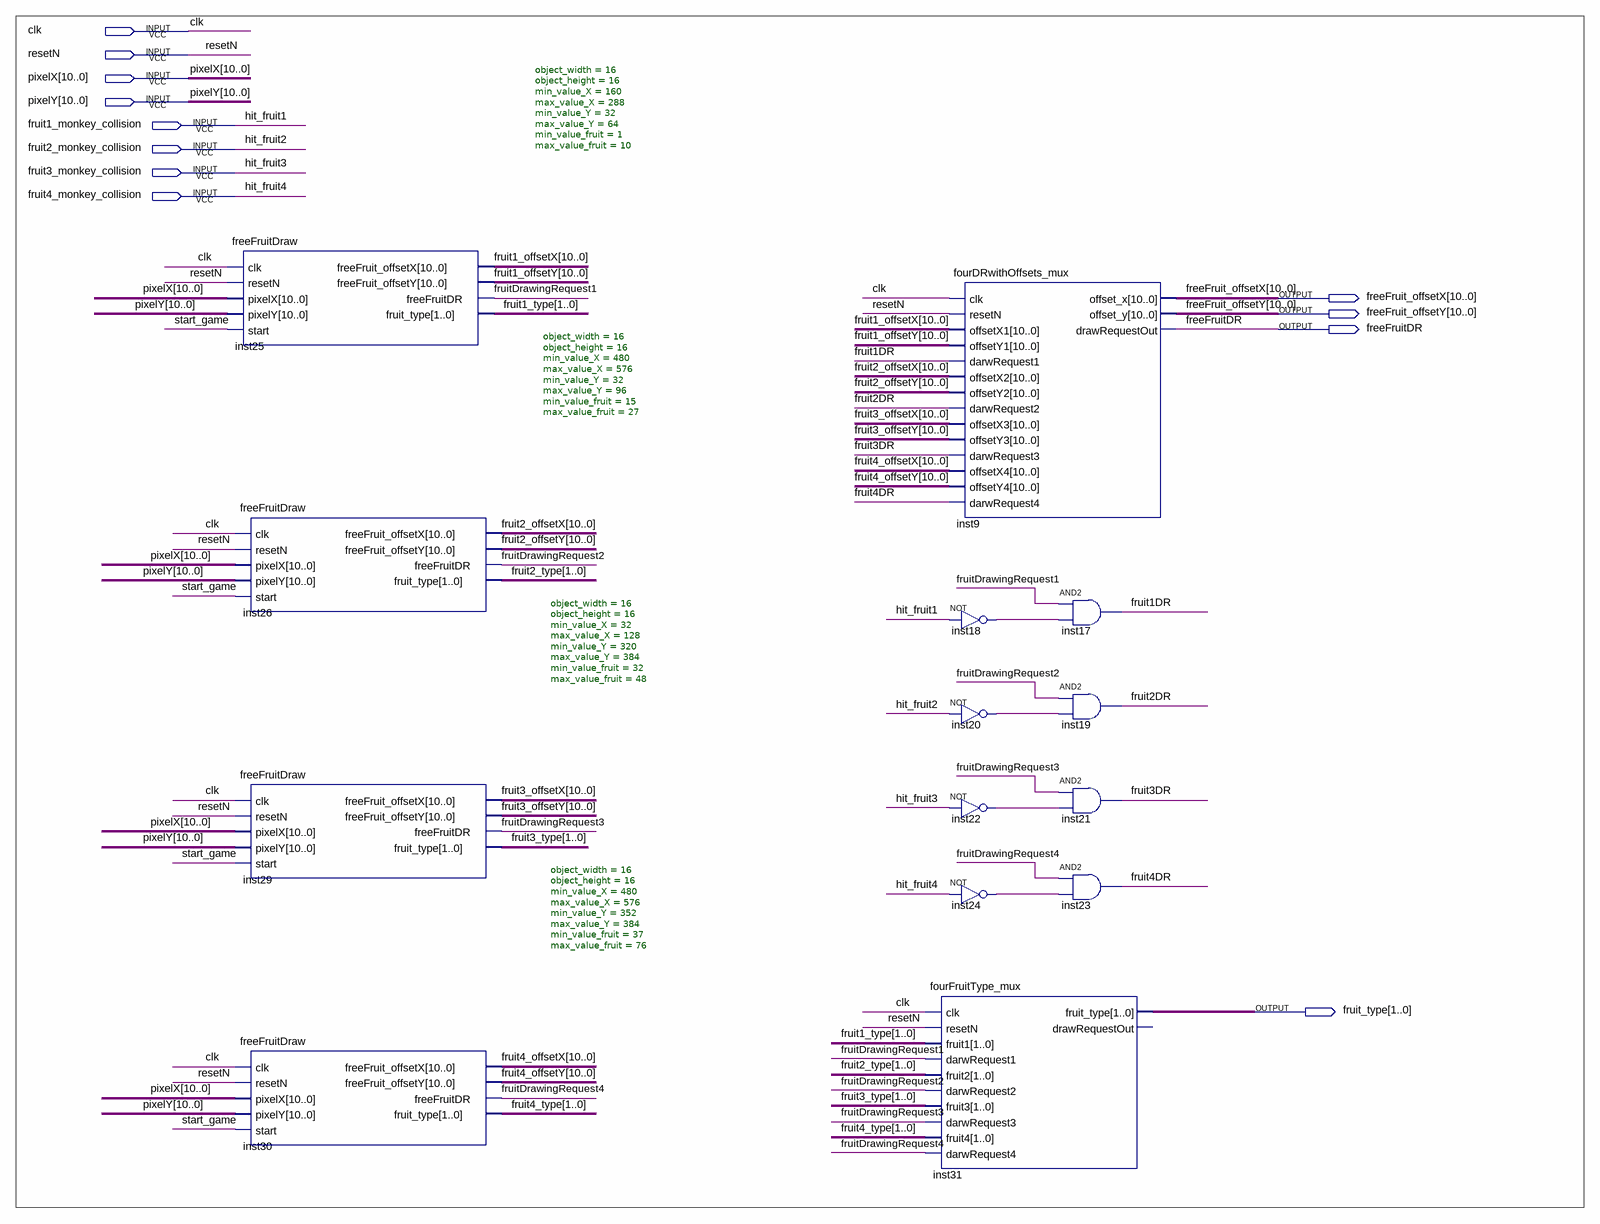
[diagram p0: schematic sheet]
// Quartus schematic freeFruitBlockexample.bdf as structural Verilog: 14 symbols, 12 pins
module freeFruitBlockexample (
  input  clk,
  input  resetN,
  input  [10:0] pixelX,
  input  [10:0] pixelY,
  input  fruit1_monkey_collision,
  input  fruit2_monkey_collision,
  input  fruit3_monkey_collision,
  input  fruit4_monkey_collision,
  output [10:0] freeFruit_offsetX,
  output [10:0] freeFruit_offsetY,
  output freeFruitDR,
  output [1:0] fruit_type
);

  wire fruit1DR, fruit2DR, fruit3DR, fruit4DR, fruitDrawingRequest1, fruitDrawingRequest2,
       fruitDrawingRequest3, fruitDrawingRequest4, inst18_out, inst20_out, inst22_out, inst24_out, start_game;
  wire [1:0] fruit1_type, fruit2_type, fruit3_type, fruit4_type;
  wire [10:0] fruit1_offsetX, fruit1_offsetY, fruit2_offsetX, fruit2_offsetY, fruit3_offsetX, fruit3_offsetY,
       fruit4_offsetX, fruit4_offsetY;

  freeFruitDraw #(.object_width(16), .object_height(16), .min_value_X(160), .max_value_X(288), .min_value_Y(32), .max_value_Y(64), .min_value_fruit(1), .max_value_fruit(10)) inst25 (
    .clk(clk), .resetN(resetN), .pixelX(pixelX), .pixelY(pixelY), .start(start_game),
    .freeFruit_offsetX(fruit1_offsetX), .freeFruit_offsetY(fruit1_offsetY),
    .freeFruitDR(fruitDrawingRequest1), .fruit_type(fruit1_type));
  freeFruitDraw #(.object_width(16), .object_height(16), .min_value_X(480), .max_value_X(576), .min_value_Y(32), .max_value_Y(96), .min_value_fruit(15), .max_value_fruit(27)) inst26 (
    .clk(clk), .resetN(resetN), .pixelX(pixelX), .pixelY(pixelY), .start(start_game),
    .freeFruit_offsetX(fruit2_offsetX), .freeFruit_offsetY(fruit2_offsetY),
    .freeFruitDR(fruitDrawingRequest2), .fruit_type(fruit2_type));
  freeFruitDraw #(.object_width(16), .object_height(16), .min_value_X(32), .max_value_X(128), .min_value_Y(320), .max_value_Y(384), .min_value_fruit(32), .max_value_fruit(48)) inst29 (
    .clk(clk), .resetN(resetN), .pixelX(pixelX), .pixelY(pixelY), .start(start_game),
    .freeFruit_offsetX(fruit3_offsetX), .freeFruit_offsetY(fruit3_offsetY),
    .freeFruitDR(fruitDrawingRequest3), .fruit_type(fruit3_type));
  freeFruitDraw #(.object_width(16), .object_height(16), .min_value_X(480), .max_value_X(576), .min_value_Y(352), .max_value_Y(384), .min_value_fruit(37), .max_value_fruit(76)) inst30 (
    .clk(clk), .resetN(resetN), .pixelX(pixelX), .pixelY(pixelY), .start(start_game),
    .freeFruit_offsetX(fruit4_offsetX), .freeFruit_offsetY(fruit4_offsetY),
    .freeFruitDR(fruitDrawingRequest4), .fruit_type(fruit4_type));
  fourFruitType_mux inst31 (
    .clk(clk), .resetN(resetN), .fruit1(fruit1_type), .darwRequest1(fruitDrawingRequest1),
    .fruit2(fruit2_type), .darwRequest2(fruitDrawingRequest2), .fruit3(fruit3_type),
    .darwRequest3(fruitDrawingRequest3), .fruit4(fruit4_type), .darwRequest4(fruitDrawingRequest4),
    .fruit_type(fruit_type));  // open: drawRequestOut
  fourDRwithOffsets_mux inst9 (
    .clk(clk), .resetN(resetN), .offsetX1(fruit1_offsetX), .offsetY1(fruit1_offsetY),
    .darwRequest1(fruit1DR), .offsetX2(fruit2_offsetX), .offsetY2(fruit2_offsetY), .darwRequest2(fruit2DR),
    .offsetX3(fruit3_offsetX), .offsetY3(fruit3_offsetY), .darwRequest3(fruit3DR), .offsetX4(fruit4_offsetX),
    .offsetY4(fruit4_offsetY), .darwRequest4(fruit4DR), .offset_x(freeFruit_offsetX),
    .offset_y(freeFruit_offsetY), .drawRequestOut(freeFruitDR));
  not inst18 (inst18_out, fruit1_monkey_collision);
  not inst20 (inst20_out, fruit2_monkey_collision);
  not inst22 (inst22_out, fruit3_monkey_collision);
  not inst24 (inst24_out, fruit4_monkey_collision);
  and inst17 (fruit1DR, fruitDrawingRequest1, inst18_out);
  and inst19 (fruit2DR, fruitDrawingRequest2, inst20_out);
  and inst21 (fruit3DR, fruitDrawingRequest3, inst22_out);
  and inst23 (fruit4DR, fruitDrawingRequest4, inst24_out);

  // Other names for the same wires on the sheet: hit_fruit1 = fruit1_monkey_collision;
  //   hit_fruit2 = fruit2_monkey_collision; hit_fruit3 = fruit3_monkey_collision;
  //   hit_fruit4 = fruit4_monkey_collision
endmodule
